# EAGLE schematic Schematic (EAGLE 6.5.0)
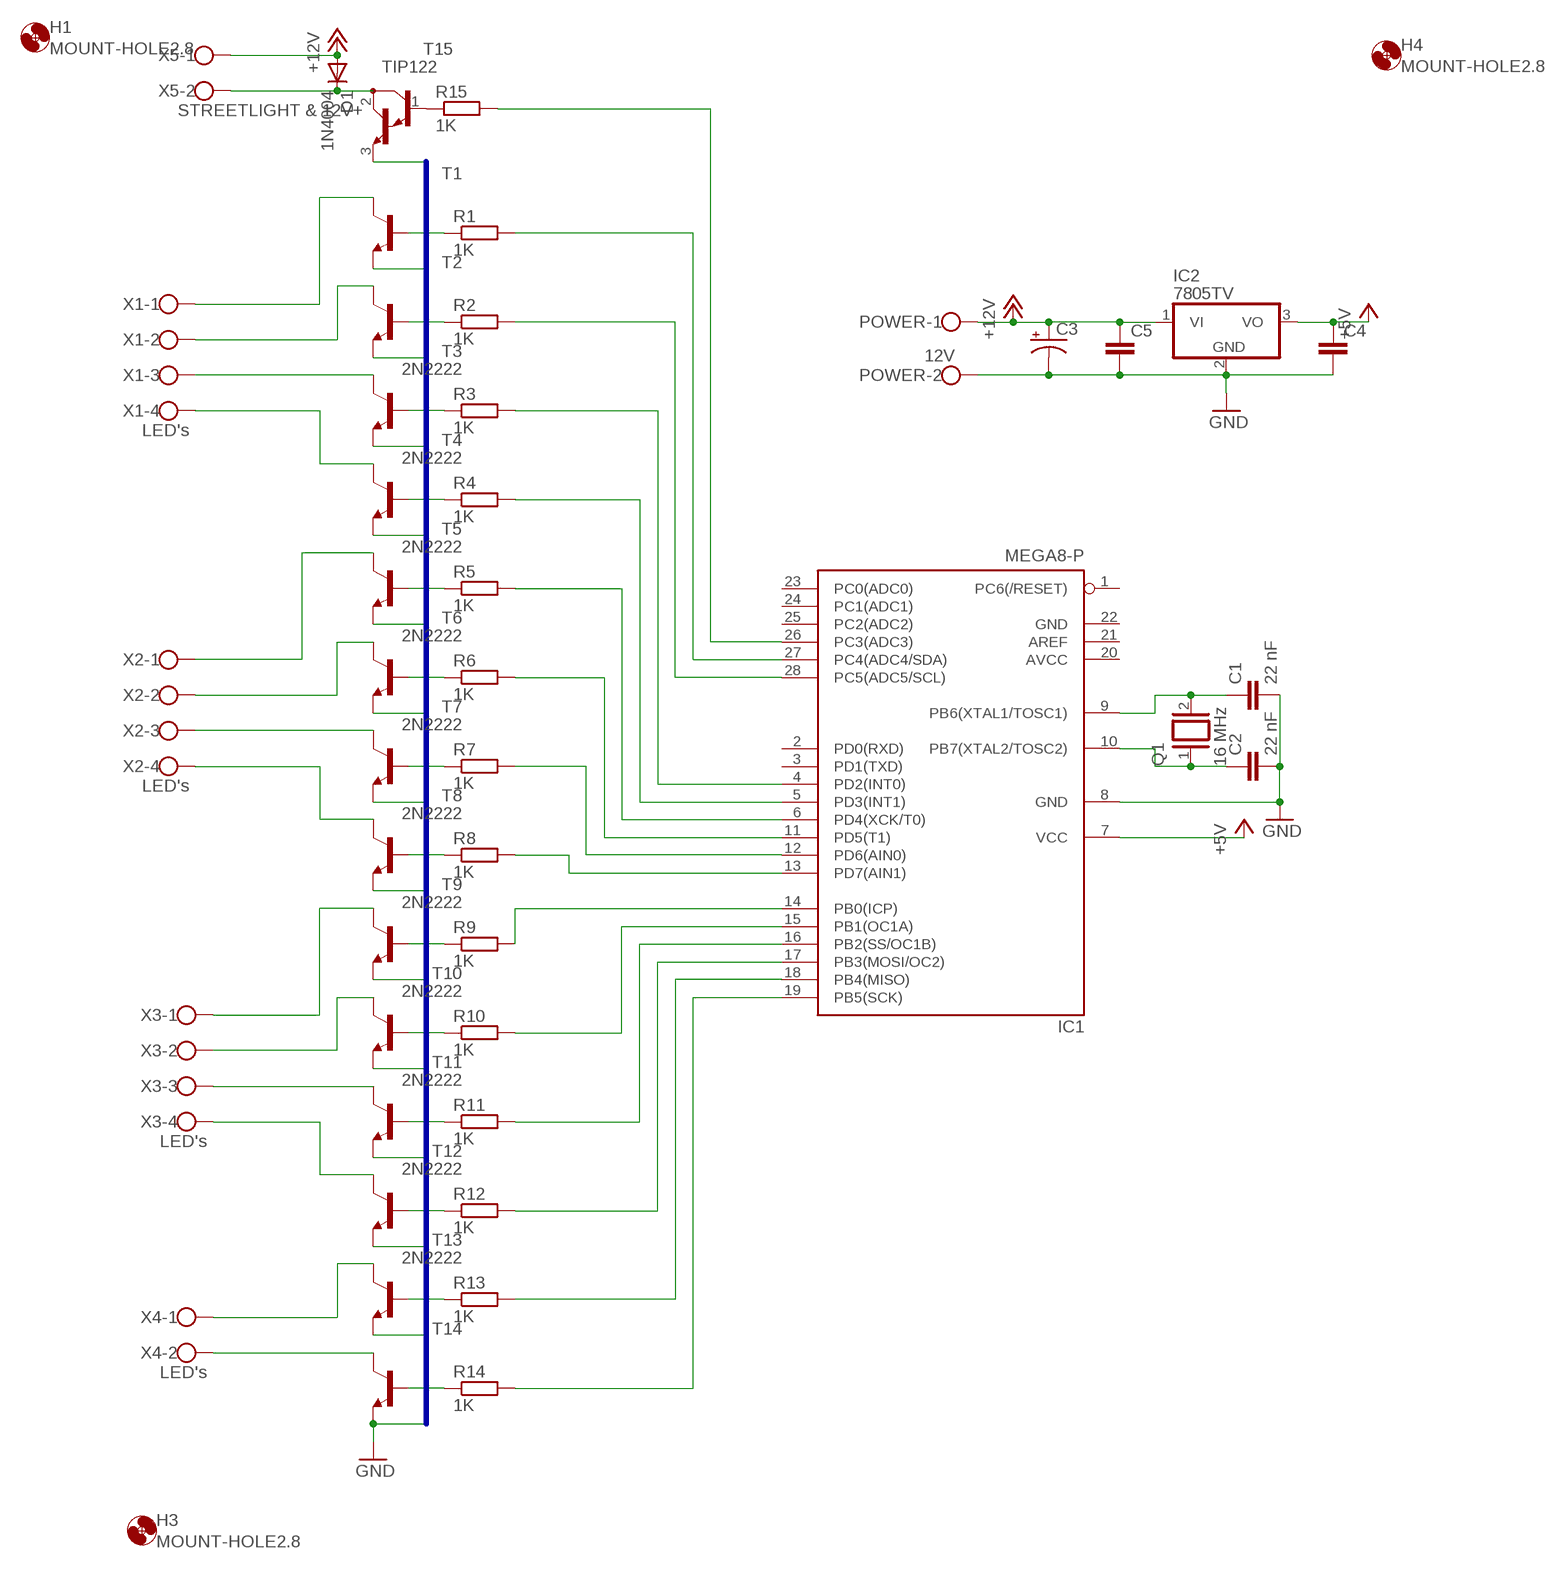
[diagram p0: schematic, sheet 1]

## Parts
C1  22 nF  C2.5/2  [C2.5-2]
C2  22 nF  C2.5/2  [C2.5-2]
C3  CPOL-USE5-13  [E5-13]
C4  C2.5/2  [C2.5-2]
C5  C2.5/2  [C2.5-2]
D1  1N4004  [DO41-10]
H1  MOUNT-HOLE2.8  [2,8]
H3  MOUNT-HOLE2.8  [2,8]
H4  MOUNT-HOLE2.8  [2,8]
IC1  MEGA8-P  [DIL28-3]
IC2  7805TV  [TO220V]
POWER  12V  W237-102  [W237-102]
Q1  16 MHz  XTAL/S  [QS]
R1  1K  R0207/10  [0207/10]
R2  1K  R0207/10  [0207/10]
R3  1K  R0207/10  [0207/10]
R4  1K  R0207/10  [0207/10]
R5  1K  R0207/10  [0207/10]
R6  1K  R0207/10  [0207/10]
R7  1K  R0207/10  [0207/10]
R8  1K  R0207/10  [0207/10]
R9  1K  R0207/10  [0207/10]
R10  1K  R0207/10  [0207/10]
R11  1K  R0207/10  [0207/10]
R12  1K  R0207/10  [0207/10]
R13  1K  R0207/10  [0207/10]
R14  1K  R0207/10  [0207/10]
R15  1K  R0207/10  [0207/10]
T1  -NPN-TO92-EBC  [TO92-EBC]
T2  -NPN-TO92-EBC  [TO92-EBC]
T3  2N2222  -NPN-TO92-EBC  [TO92-EBC]
T4  2N2222  -NPN-TO92-EBC  [TO92-EBC]
T5  2N2222  -NPN-TO92-EBC  [TO92-EBC]
T6  2N2222  -NPN-TO92-EBC  [TO92-EBC]
T7  2N2222  -NPN-TO92-EBC  [TO92-EBC]
T8  2N2222  -NPN-TO92-EBC  [TO92-EBC]
T9  2N2222  -NPN-TO92-EBC  [TO92-EBC]
T10  2N2222  -NPN-TO92-EBC  [TO92-EBC]
T11  2N2222  -NPN-TO92-EBC  [TO92-EBC]
T12  2N2222  -NPN-TO92-EBC  [TO92-EBC]
T13  2N2222  -NPN-TO92-EBC  [TO92-EBC]
T14  -NPN-TO92-EBC  [TO92-EBC]
T15  TIP122  [TO220]
X1  LED's  W237-4  [W237-4]
X2  LED's  W237-4  [W237-4]
X3  LED's  W237-4  [W237-4]
X4  LED's  W237-102  [W237-102]
X5  STREETLIGHT & 12V+  W237-102  [W237-102]

## Nets
+5V: C4.1 IC1.7(VCC) IC2.3(VO)
+12V: C3.+ C5.1 D1.A IC2.1(VI) POWER.1 X5.1
GND: C1.2 C2.2 C3.- C4.2 C5.2 IC1.8(GND) IC2.2(GND) POWER.2 T1.E T2.E T3.E T4.E T5.E T6.E T7.E T8.E T9.E T10.E T11.E T12.E T13.E T14.E T15.3(E)
N$1: R9.1 T9.B
N$2: R10.1 T10.B
N$3: R11.1 T11.B
N$4: R12.1 T12.B
N$5: R13.1 T13.B
N$6: R14.1 T14.B
N$7: R6.1 T6.B
N$8: R5.1 T5.B
N$9: R7.1 T7.B
N$10: R8.1 T8.B
N$11: R4.1 T4.B
N$12: R3.1 T3.B
N$13: R2.1 T2.B
N$14: R1.1 T1.B
N$15: T7.C X2.3
N$17: T3.C X1.3
N$21: T5.C X2.1
N$22: T8.C X2.4
N$23: T9.C X3.1
N$24: T10.C X3.2
N$25: T11.C X3.3
N$26: T12.C X3.4
N$27: T13.C X4.1
N$28: T14.C X4.2
N$29: IC1.19(PB5(SCK)) R14.2
N$30: IC1.18(PB4(MISO)) R13.2
N$31: IC1.17(PB3(MOSI/OC2)) R12.2
N$32: IC1.16(PB2(SS/OC1B)) R11.2
N$33: IC1.15(PB1(OC1A)) R10.2
N$34: IC1.14(PB0(ICP)) R9.2
N$35: IC1.27(PC4(ADC4/SDA)) R1.2
N$36: IC1.28(PC5(ADC5/SCL)) R2.2
N$37: IC1.4(PD2(INT0)) R3.2
N$38: IC1.5(PD3(INT1)) R4.2
N$39: IC1.6(PD4(XCK/T0)) R5.2
N$40: IC1.11(PD5(T1)) R6.2
N$41: IC1.12(PD6(AIN0)) R7.2
N$42: IC1.13(PD7(AIN1)) R8.2
N$43: R15.1 T15.1(B)
N$44: C1.1 IC1.9(PB6(XTAL1/TOSC1)) Q1.2
N$45: C2.1 IC1.10(PB7(XTAL2/TOSC2)) Q1.1
N$46: T6.C X2.2
N$47: T4.C X1.4
N$48: D1.C T15.2(C) X5.2
N$49: T1.C X1.1
N$50: T2.C X1.2
N$53: IC1.26(PC3(ADC3)) R15.2
Unconnected: IC1.1(PC6(/RESET)) IC1.2(PD0(RXD)) IC1.3(PD1(TXD)) IC1.21(AREF) IC1.23(PC0(ADC0)) IC1.24(PC1(ADC1)) IC1.25(PC2(ADC2))

## Buses
B$1

## Power pins joined to a net without a drawn wire
AVCC: IC1.20(AVCC)
GND: IC1.22(GND)

## Library data of the parts
C1 C2 C4 C5 = capacitor-wima:C: CAPACITOR naming: grid - package width
C3 = resistor:CPOL-US: POLARIZED CAPACITOR, American symbol
D1 = diode:1N4004: DIODE general purpose rectifier, 1 A
H1 H3 H4 = holes:MOUNT-HOLE: MOUNTING HOLE with drill center marker
IC1 = atmel:MEGA8-P: MICROCONTROLLER 8 Kbytes FLASH, 1 kbytes SRAM, 512 bytes EEPROM, USART, 4-channel 10 bit ADC, 2-channel 8 bit ADC Pin compatible with Atmega48, ATMega88, ATMega168 Source: avr.lbr; OC_FARNELL: unknown; OC_NEWARK: unknown
IC2 = linear:78*: Positive VOLTAGE REGULATOR Source: http://cache.national.com/ds/LM/LM78L05.pdf http://www.fairchildsemi.com/ds/LM/LM7805.pdf
POWER X4 X5 = con-wago-500:W237-102: WAGO SCREW CLAMP; MPN: 237-102; OC_FARNELL: unknown; OC_NEWARK: 70K9898
Q1 = special:XTAL/S: CRYSTAL
R1-R15 = eagle-ltspice:R: RESISTOR, European symbol; SPICEMODEL: NONE; SPICEPREFIX: R
T1-T14 = transistor-neu-to92:*-NPN-: NPN Transistror
T15 = transistor:TIP122: NPN BIPOLAR DARLINGTON TRANSISTOR
X1-X3 = con-wago-500:W237-4: WAGO SCREW CLAMP; OC_FARNELL: unknown; OC_NEWARK: unknown